# EAGLE design TouchSwitch-V2.0 (EAGLE 9.6.2)
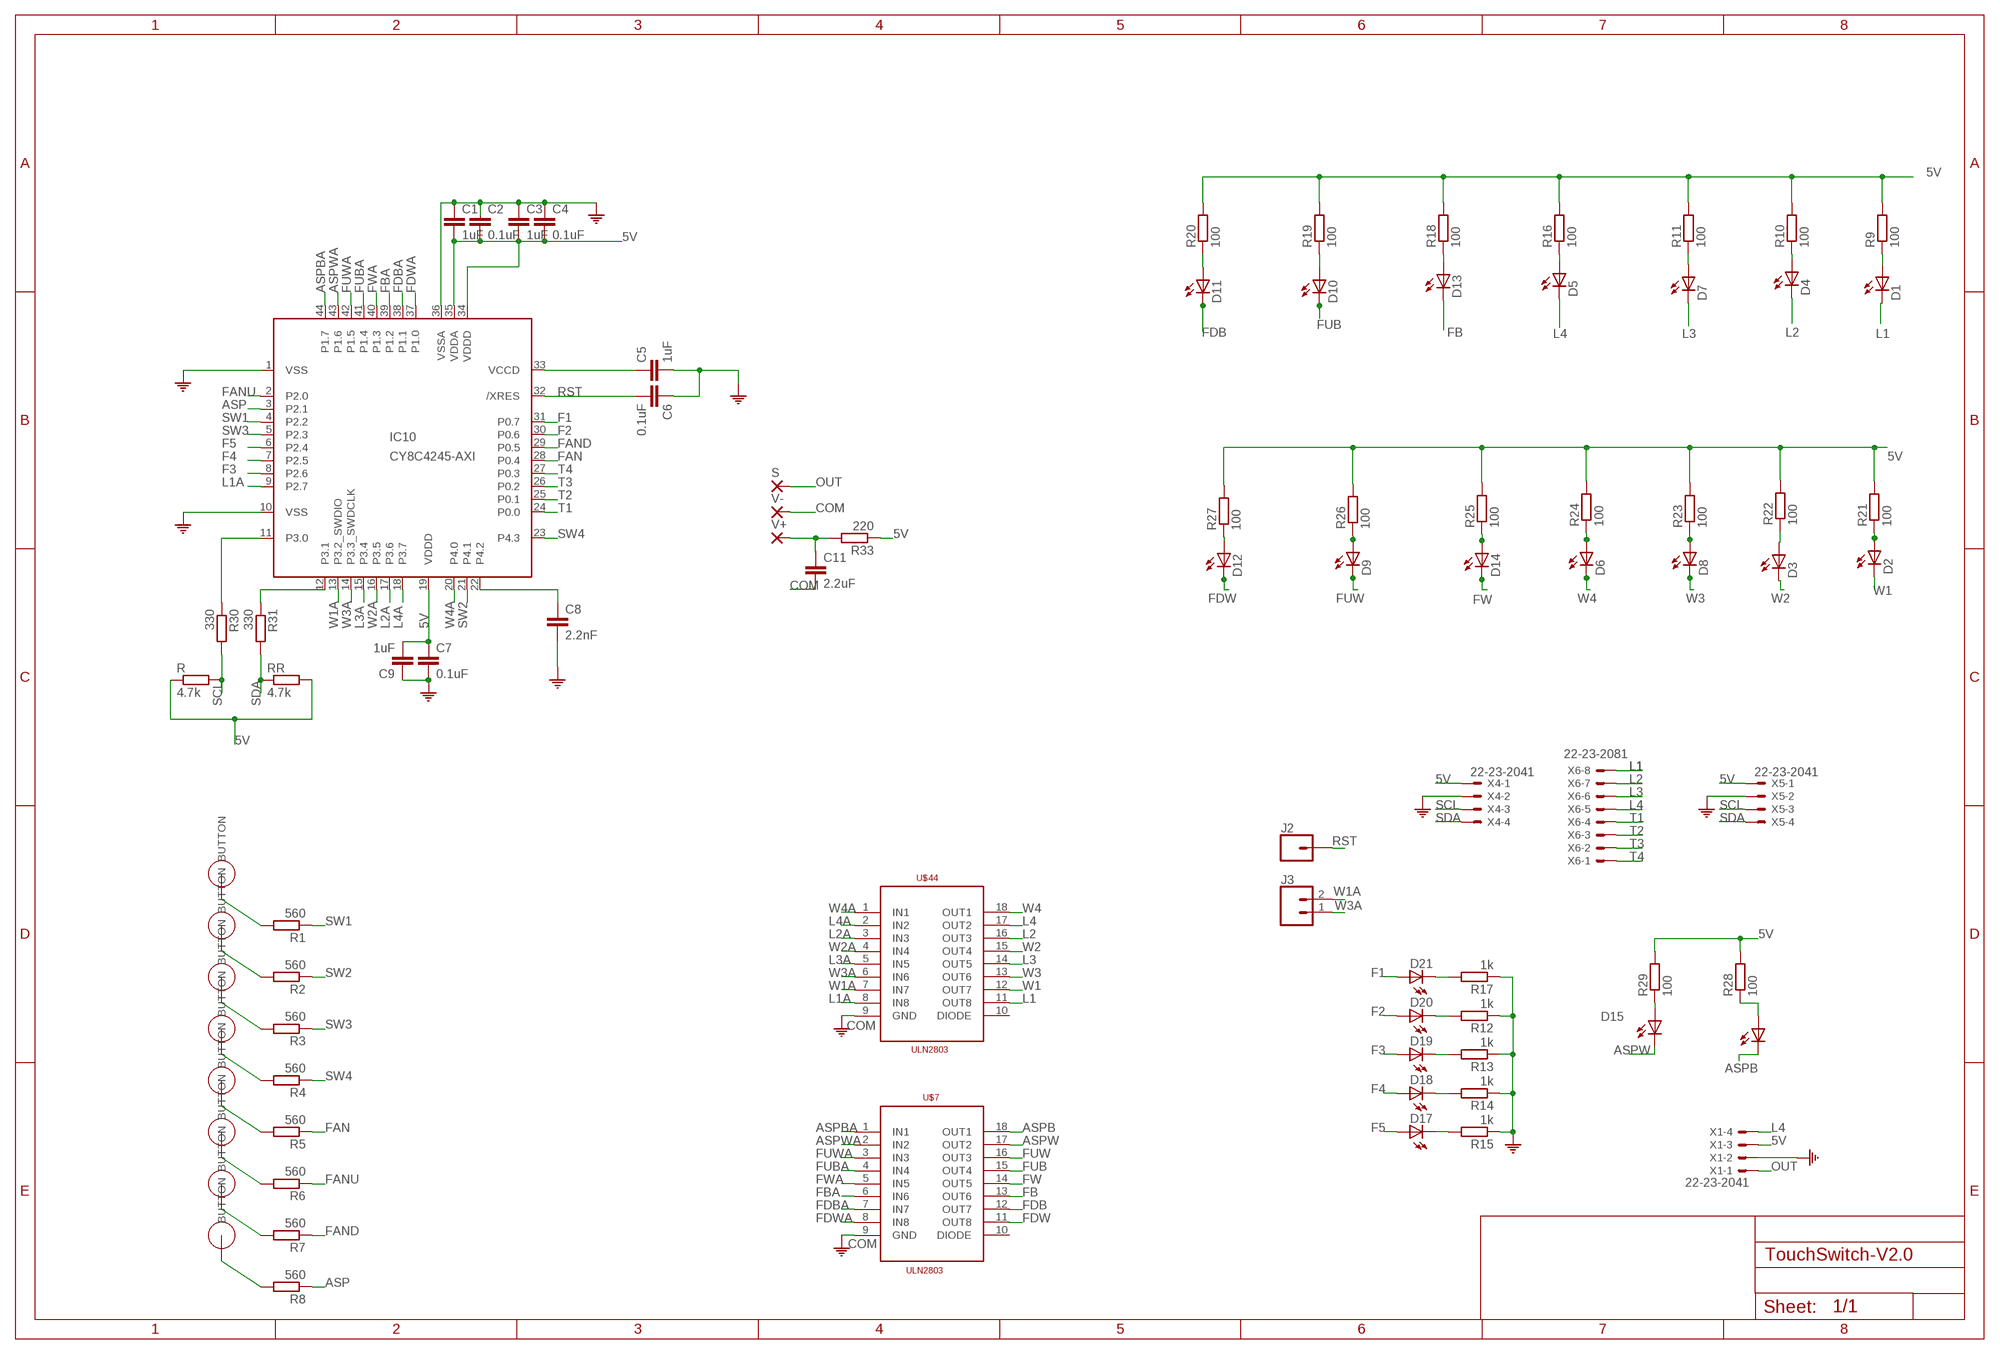
[diagram p0: schematic, sheet 1]

## Parts
B1  BUTTON_PASSIVE12MM  [BUTTON_PASSIVE_12MM]
B2  BUTTON_PASSIVE12MM  [BUTTON_PASSIVE_12MM]
B3  BUTTON_PASSIVE12MM  [BUTTON_PASSIVE_12MM]
B4  BUTTON_PASSIVE12MM  [BUTTON_PASSIVE_12MM]
B5  BUTTON_PASSIVE12MM  [BUTTON_PASSIVE_12MM]
B6  BUTTON_PASSIVE12MM  [BUTTON_PASSIVE_12MM]
B7  BUTTON_PASSIVE12MM  [BUTTON_PASSIVE_12MM]
B8  BUTTON_PASSIVE12MM  [BUTTON_PASSIVE_12MM]
C1  1uF  C-EUC1206  [C1206]
C2  0.1uF  C-EUC1206  [C1206]
C3  1uF  C-EUC1206  [C1206]
C4  0.1uF  C-EUC1206  [C1206]
C5  1uF  C-EUC1206  [C1206]
C6  0.1uF  C-EUC1206  [C1206]
C7  0.1uF  C-EUC1206  [C1206]
C8  2.2nF  C-EUC1206  [C1206]
C9  1uF  C-EUC1206  [C1206]
C11  2.2uF  C-EUC1206  [C1206]
D1  LEDCHIPLED_1206  [CHIPLED_1206]
D2  LEDCHIPLED_1206  [CHIPLED_1206]
D3  LEDCHIPLED_1206  [CHIPLED_1206]
D4  LEDCHIPLED_1206  [CHIPLED_1206]
D5  LEDCHIPLED_1206  [CHIPLED_1206]
D6  LEDCHIPLED_1206  [CHIPLED_1206]
D7  LEDCHIPLED_1206  [CHIPLED_1206]
D8  LEDCHIPLED_1206  [CHIPLED_1206]
D9  LEDCHIPLED_1206  [CHIPLED_1206]
D10  LEDCHIPLED_1206  [CHIPLED_1206]
D11  LEDCHIPLED_1206  [CHIPLED_1206]
D12  LEDCHIPLED_1206  [CHIPLED_1206]
D13  LEDCHIPLED_1206  [CHIPLED_1206]
D14  LEDCHIPLED_1206  [CHIPLED_1206]
D15  LEDCHIPLED_1206  [CHIPLED_1206]
D16  LEDCHIPLED_1206  [CHIPLED_1206]
D17  LEDCHIPLED_1206  [CHIPLED_1206]
D18  LEDCHIPLED_1206  [CHIPLED_1206]
D19  LEDCHIPLED_1206  [CHIPLED_1206]
D20  LEDCHIPLED_1206  [CHIPLED_1206]
D21  LEDCHIPLED_1206  [CHIPLED_1206]
IC10  CY8C4245-AXI  [44-TQFP-0.8]
J2  CONN_01  [1X01]
J3  CONN_02  [1X02]
R  4.7k  R-EU_R0805  [R0805]
R1  560  R-EU_R0805  [R0805]
R2  560  R-EU_R0805  [R0805]
R3  560  R-EU_R0805  [R0805]
R4  560  R-EU_R0805  [R0805]
R5  560  R-EU_R0805  [R0805]
R6  560  R-EU_R0805  [R0805]
R7  560  R-EU_R0805  [R0805]
R8  560  R-EU_R0805  [R0805]
R9  100  R-EU_R0805  [R0805]
R10  100  R-EU_R0805  [R0805]
R11  100  R-EU_R0805  [R0805]
R12  1k  R-EU_R0805  [R0805]
R13  1k  R-EU_R0805  [R0805]
R14  1k  R-EU_R0805  [R0805]
R15  1k  R-EU_R0805  [R0805]
R16  100  R-EU_R0805  [R0805]
R17  1k  R-EU_R0805  [R0805]
R18  100  R-EU_R0805  [R0805]
R19  100  R-EU_R0805  [R0805]
R20  100  R-EU_R0805  [R0805]
R21  100  R-EU_R0805  [R0805]
R22  100  R-EU_R0805  [R0805]
R23  100  R-EU_R0805  [R0805]
R24  100  R-EU_R0805  [R0805]
R25  100  R-EU_R0805  [R0805]
R26  100  R-EU_R0805  [R0805]
R27  100  R-EU_R0805  [R0805]
R28  100  R-EU_R0805  [R0805]
R29  100  R-EU_R0805  [R0805]
R30  330  R-EU_R0805  [R0805]
R31  330  R-EU_R0805  [R0805]
R33  220  R-EU_R0805  [R0805]
RR  4.7k  R-EU_R0805  [R0805]
S  SMD2  [SMD1,27-2,54]
U$7  ULN2803  [SO18L]
U$44  ULN2803  [SO18L]
V+  SMD2  [SMD1,27-2,54]
V-  SMD2  [SMD1,27-2,54]
X1  22-23-2041  [22-23-2041]
X4  22-23-2041  [22-23-2041]
X5  22-23-2041  [22-23-2041]
X6  22-23-2081  [22-23-2081]

## Nets
5V: C1.2 C2.2 C3.2 C4.2 C7.1 C9.2 IC10.19(VDDD) IC10.34(VDDD) IC10.35(VDDA) R9.2 R10.2 R11.2 R16.2 R18.2 R19.2 R20.2 R21.2 R22.2 R23.2 R24.2 R25.2 R26.2 R27.2 R28.2 R29.2 R33.1 R.1 RR.2 X1.3 X4.1 X5.1
ASP: IC10.3(P2.1) R8.1
ASPB: D16.C U$7.18(OUT1)
ASPBA: IC10.44(P1.7) U$7.1(IN1)
ASPW: D15.C U$7.17(OUT2)
ASPWA: IC10.43(P1.6) U$7.2(IN2)
COM: C1.1 C2.1 C3.1 C4.1 C5.2 C6.1 C7.2 C8.2 C9.1 C11.2 IC10.1(VSS) IC10.10(VSS) IC10.36(VSSA) R12.1 R13.1 R14.1 R15.1 R17.1 U$7.9(GND) U$44.9(GND) V-.1(P) X1.2 X4.2 X5.2
F1: D21.A IC10.31(P0.7)
F2: D20.A IC10.30(P0.6)
F3: D19.A IC10.8(P2.6)
F4: D18.A IC10.7(P2.5)
F5: D17.A IC10.6(P2.4)
FAN: IC10.28(P0.4) R5.1
FAND: IC10.29(P0.5) R7.1
FANU: IC10.2(P2.0) R6.1
FB: D13.C U$7.13(OUT6)
FBA: IC10.39(P1.2) U$7.6(IN6)
FDB: D11.C U$7.12(OUT7)
FDBA: IC10.38(P1.1) U$7.7(IN7)
FDW: D12.C U$7.11(OUT8)
FDWA: IC10.37(P1.0) U$7.8(IN8)
FUB: D10.C U$7.15(OUT4)
FUBA: IC10.41(P1.4) U$7.4(IN4)
FUW: D9.C U$7.16(OUT3)
FUWA: IC10.42(P1.5) U$7.3(IN3)
FW: D14.C U$7.14(OUT5)
FWA: IC10.40(P1.3) U$7.5(IN5)
L1: D1.C U$44.11(OUT8) X6.8
L1A: IC10.9(P2.7) U$44.8(IN8)
L2: D4.C U$44.16(OUT3) X6.7
L2A: IC10.17(P3.6) U$44.3(IN3)
L3: D7.C U$44.14(OUT5) X6.6
L3A: IC10.15(P3.4) U$44.5(IN5)
L4: D5.C U$44.17(OUT2) X1.4 X6.5
L4A: IC10.18(P3.7) U$44.2(IN2)
N$1: C8.1 IC10.22(P4.2)
N$2: B8.T.PAD(BUTTON) R1.2
N$3: IC10.11(P3.0) R30.1
N$4: B1.T.PAD(BUTTON) R2.2
N$5: IC10.12(P3.1) R31.1
N$6: D10.A R19.1
N$7: B2.T.PAD(BUTTON) R3.2
N$8: B3.T.PAD(BUTTON) R4.2
N$9: B4.T.PAD(BUTTON) R5.2
N$10: B5.T.PAD(BUTTON) R6.2
N$11: B6.T.PAD(BUTTON) R7.2
N$12: D13.A R18.1
N$13: C11.1 R33.2 V+.1(P)
N$14: D11.A R20.1
N$15: D5.A R16.1
N$16: B7.T.PAD(BUTTON) R8.2
N$17: D7.A R11.1
N$18: D20.C R12.2
N$19: D19.C R13.2
N$20: D18.C R14.2
N$21: D17.C R15.2
N$22: D21.C R17.2
N$23: D4.A R10.1
N$24: D1.A R9.1
N$25: D6.A R24.1
N$26: D12.A R27.1
N$27: D9.A R26.1
N$28: D14.A R25.1
N$29: D2.A R21.1
N$30: D3.A R22.1
N$31: D8.A R23.1
N$32: D16.A R28.1
N$34: D15.A R29.1
N$47: C5.1 IC10.33(VCCD)
OUT: S.1(P) X1.1
RST: C6.2 IC10.32(/XRES) J2.1
SCL: R30.2 R.2 X4.3 X5.3
SDA: R31.2 RR.1 X4.4 X5.4
SW1: IC10.4(P2.2) R1.1
SW2: IC10.21(P4.1) R2.1
SW3: IC10.5(P2.3) R3.1
SW4: IC10.23(P4.3) R4.1
T1: IC10.24(P0.0) X6.4
T2: IC10.25(P0.1) X6.3
T3: IC10.26(P0.2) X6.2
T4: IC10.27(P0.3) X6.1
W1: D2.C U$44.12(OUT7)
W1A: IC10.13(P3.2_SWDIO) J3.2 U$44.7(IN7)
W2: D3.C U$44.15(OUT4)
W2A: IC10.16(P3.5) U$44.4(IN4)
W3: D8.C U$44.13(OUT6)
W3A: IC10.14(P3.3_SWDCLK) J3.1 U$44.6(IN6)
W4: D6.C U$44.18(OUT1)
W4A: IC10.20(P4.0) U$44.1(IN1)
Unconnected: U$7.10(DIODE) U$44.10(DIODE)

## Library data of the parts
B1-B8 = touch_pad_:BUTTON_PASSIVE: Button, Passive Capacitive/Touch Sensing Type Source : http://www.PatternAgents.com Github : https://github.com/PatternAgents License : http://creativecommons.org/licenses/by-sa/3.1/ (Creative Commons 3.1) THIS SOFTWARE IS PROVIDED BY THE CONTRIBUTORS "AS IS" AND WITHOUT ANY EXPRESS OR IMPLIED WARRANTIES, INCLUDING, BUT NOT LIMITED TO, THE IMPLIED WARRANTIES OF MERCHANTABILITY AND FITNESS FOR A PARTICULAR PURPOSE ARE DISCLAIMED. IN NO EVENT SHALL THE COPYRIGHT OWNER OR CONTRIBUTORS BE LIABLE FOR ANY DIRECT, INDIRECT, INCIDENTAL, SPECIAL, EXEMPLARY, OR CONSEQUENTIAL DAMAGES (INCLUDING, BUT NOT LIMITED TO, PROCUREMENT OF SUBSTITUTE GOODS OR SERVICES; LOSS OF USE, DATA, OR PROFITS; OR BUSINESS INTERRUPTION) HOWEVER CAUSED AND ON ANY THEORY OF LIABILITY, WHETHER IN CONTRACT, STRICT LIABILITY, OR TORT (INCLUDING NEGLIGENCE OR OTHERWISE) ARISING IN ANY WAY OUT OF THE USE OF THIS SOFTWARE, EVEN IF ADVISED OF THE POSSIBILITY OF SUCH DAMAGE.
C1-C9 C11 = rcl:C-EU: CAPACITOR, European symbol; SPICEPREFIX: C
D1-D21 = led:LED: LED OSRAM: - CHIPLED LG R971, LG N971, LY N971, LG Q971, LY Q971, LO R971, LY R971 LH N974, LH R974 LS Q976, LO Q976, LY Q976 LO Q996 - Hyper CHIPLED LW Q18S LB Q993, LB Q99A, LB R99A - SideLED LS A670, LO A670, LY A670, LG A670, LP A670 LB A673, LV A673, LT A673, LW A673 LH A674 LY A675 LS A676, LA A676, LO A676, LY A676, LW A676 LS A679, LY A679, LG A679 - Hyper Micro SIDELED® LS Y876, LA Y876, LO Y876, LY Y876 LT Y87S - SmartLED LW L88C, LW L88S LB L89C, LB L89S, LG L890 LS L89K, LO L89K, LY L89K LS L896, LA L896, LO L896, LY L896 - TOPLED LS T670, LO T670, LY T670, LG T670, LP T670 LSG T670, LSP T670, LSY T670, LOP T670, LYG T670 LG T671, LOG T671, LSG T671 LB T673, LV T673, LT T673, LW T673 LH T674 LS T676, LA T676, LO T676, LY T676, LB T676, LH T676, LSB T676, LW T676 LB T67C, LV T67C, LT T67C, LS T67K, LO T67K, LY T67K, LW E67C LS E67B, LA E67B, LO E67B, LY E67B, LB E67C, LV E67C, LT E67C LW T67C LS T679, LY T679, LG T679 LS T770, LO T770, LY T770, LG T770, LP T770 LB T773, LV T773, LT T773, LW T773 LH T774 LS E675, LA E675, LY E675, LS T675 LS T776, LA T776, LO T776, LY T776, LB T776 LHGB T686 LT T68C, LB T68C - Hyper Mini TOPLED® LB M676 - Mini TOPLED Santana® LG M470 LS M47K, LO M47K, LY M47K Source: http://www.osram.convergy.de LUXEON: - LUMILED® LXK2-PW12-R00, LXK2-PW12-S00, LXK2-PW14-U00, LXK2-PW14-V00 LXK2-PM12-R00, LXK2-PM12-S00, LXK2-PM14-U00 LXK2-PE12-Q00, LXK2-PE12-R00, LXK2-PE12-S00, LXK2-PE14-T00, LXK2-PE14-U00 LXK2-PB12-K00, LXK2-PB12-L00, LXK2-PB12-M00, LXK2-PB14-N00, LXK2-PB14-P00, LXK2-PB14-Q00 LXK2-PR12-L00, LXK2-PR12-M00, LXK2-PR14-Q00, LXK2-PR14-R00 LXK2-PD12-Q00, LXK2-PD12-R00, LXK2-PD12-S00 LXK2-PH12-R00, LXK2-PH12-S00 LXK2-PL12-P00, LXK2-PL12-Q00, LXK2-PL12-R00 Source: www.luxeon.com KINGBRIGHT: KA-3528ASYC Source: www.kingbright.com
IC10 = CY8C4200:CY8C4245: PSOC4200 in TQFP-44 Source:
J2 = SparkFun-Connectors ASPIRE:CONN_01: Single connection point. Often used as Generic Header-pin footprint for 0.1 inch spaced/style header connections On any of the 0.1 inch spaced packages, you can populate with these: Break Away Headers - Straight <https://www.sparkfun.com/products/116> (PRT-00116) Break Away Male Headers - Right Angle <https://www.sparkfun.com/products/553> (PRT-00553) Female Headers <https://www.sparkfun.com/products/115> (PRT-00115) Break Away Headers - Machine Pin <https://www.sparkfun.com/products/117> (PRT-00117) Break Away Female Headers - Swiss Machine Pin <https://www.sparkfun.com/products/743> (PRT-00743) This device is also useful as a general connection point to wire up your design to another part of your project. Our various solder wires solder well into these plated through hole pads. Hook-Up Wire - Assortment (Stranded, 22 AWG) <https://www.sparkfun.com/products/11375> (PRT-11375) Hook-Up Wire - Assortment (Solid Core, 22 AWG) <https://www.sparkfun.com/products/11367> (PRT-11367) View the entire wire category on our website here <https://www.sparkfun.com/categories/141> Special notes: SMTSO-256-ET is a "flush mount" nut for a 4-40 screw. We mostly use this on specialty testbeds; it is a nice way to connect hardware to your PCB at an adjustable hieght. Also note, the SNAP packages are for using a snappable style connector. We sell a baggie of snaps and they are also used on two LilyPad designs: Snap Assortment - 30 pack (male and female) <https://www.sparkfun.com/products/11347> (DEV-11347) LilyPad Arduino SimpleSnap <https://www.sparkfun.com/products/10941> (DEV-10941) LilyPad SimpleSnap Protoboard <https://www.sparkfun.com/products/10940> (DEV-10940)
J3 = SparkFun-Connectors ASPIRE:CONN_02: Multi connection point. Often used as Generic Header-pin footprint for 0.1 inch spaced/style header connections On any of the 0.1 inch spaced packages, you can populate with these: Break Away Headers - Straight <https://www.sparkfun.com/products/116> (PRT-00116) Break Away Male Headers - Right Angle <https://www.sparkfun.com/products/553> (PRT-00553) Female Headers <https://www.sparkfun.com/products/115> (PRT-00115) Break Away Headers - Machine Pin <https://www.sparkfun.com/products/117> (PRT-00117) Break Away Female Headers - Swiss Machine Pin <https://www.sparkfun.com/products/743> (PRT-00743) For SCREWTERMINALS and SPRING TERMINALS visit here: Screw Terimnals on SparkFun.com <https://www.sparkfun.com/search/results?term=Screw+Terminals> (5mm/3.5mm/2.54mm spacing) This device is also useful as a general connection point to wire up your design to another part of your project. Our various solder wires solder well into these plated through hole pads. Hook-Up Wire - Assortment (Stranded, 22 AWG) <https://www.sparkfun.com/products/11375> (PRT-11375) Hook-Up Wire - Assortment (Solid Core, 22 AWG) <https://www.sparkfun.com/products/11367> (PRT-11367) View the entire wire category on our website here <https://www.sparkfun.com/categories/141> Special notes: Molex polarized connector foot print use with: PRT-08233 with associated crimp pins and housings. 2.54_SCREWTERM for use with PRT-10571. 3.5mm Screw Terminal footprints for PRT-08084 5mm Screw Terminal footprints for use with PRT-08432
R R1-R31 R33 RR = resistor:R-EU_: RESISTOR, European symbol
S V+ V- = wirepad:SMD2: SMD PAD
U$7 U$44 = uln2803:ULN2803
X1 X4 X5 = con-molex-new white color :22-23-2041: .100" (2.54mm) Center Header - 4 Pin
X6 = con-molex-new white color :22-23-2081: .100" (2.54mm) Center Header - 8 Pin

## Board
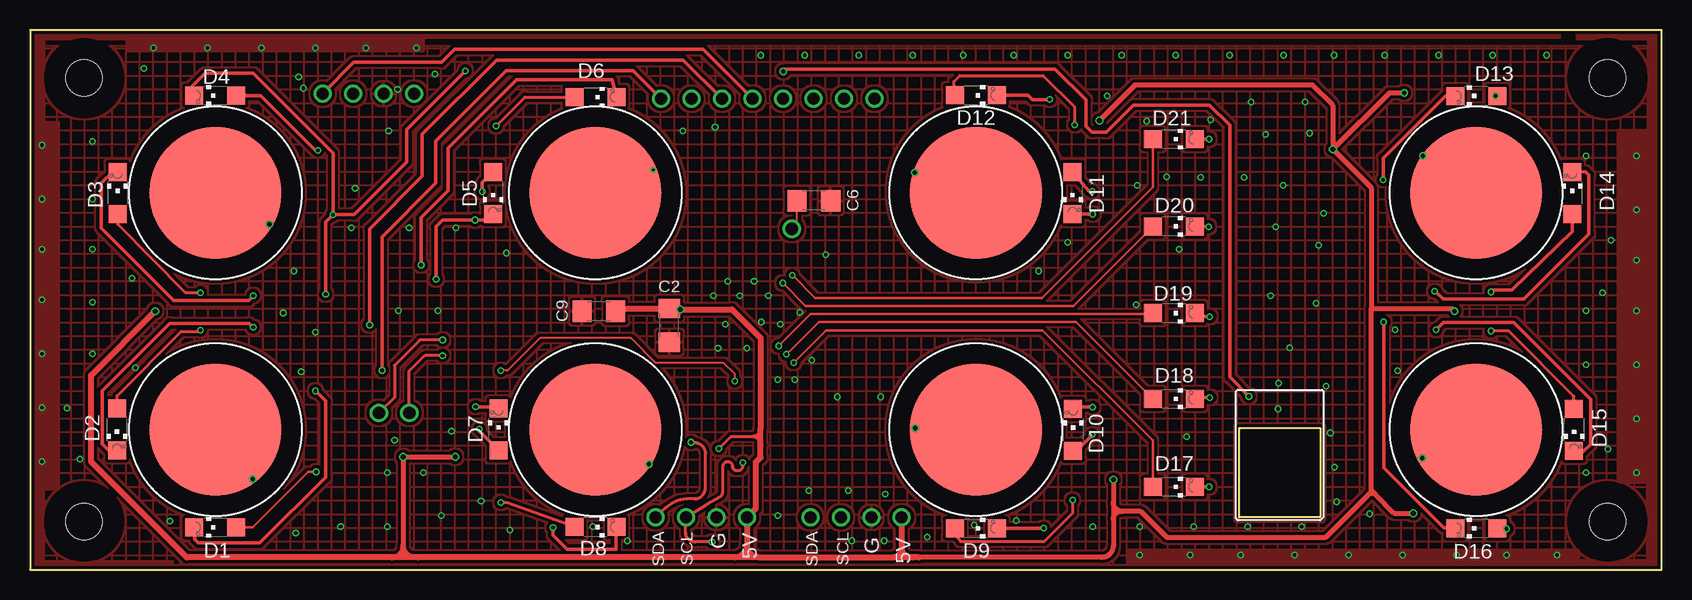
[diagram p1: board, top side]
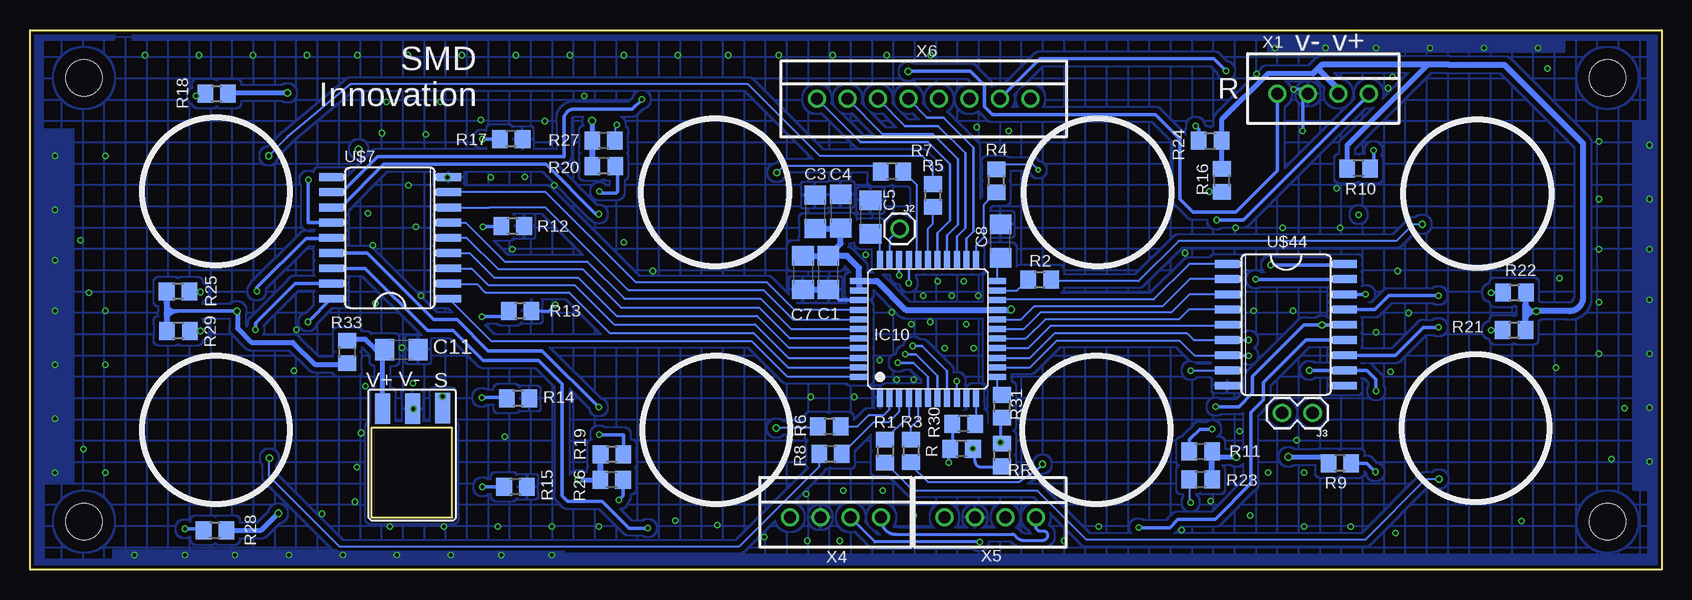
[diagram p2: board, bottom side, seen from below]

Size 136 x 45 mm. Coordinates in mm from the lower left corner, seen from the top.
Outline: 136,45 0,45 0,0 136,0 136,45
Outline: 107.55,4.35 100.8,4.35 100.8,11.8 107.55,11.8 107.55,4.35
Copper layers (1*16): Top 0.018mm / dielectric 1.55mm / Bottom 0.018mm
Design rules "eC_2Layer_PClass6_BaseCopperO18_eCDefault *": minimum track width 0.15mm, minimum drill 0.1mm, track to track 0.15mm, track to pad 0.15mm, pad to pad 0.15mm, via to via 0.15mm, smd to smd 0mil, copper to edge 0.25mm, drill to drill 0.35mm, minimum pad ring 0.175mm, minimum via ring 0.125mm, stop-mask expansion 0mil, vias tented up to drill 0.35mm, thermal gap 0.2mm
Holes 3 mm at 131.5,4 131.5,41 4.5,41 4.5,4
tRestrict: area 113.3,4.5 to 127.8,18.9; area 113.3,24.2 to 127.8,38.6; area 71.6,4.5 to 86,18.9; area 39.9,4.5 to 54.3,18.9; area 39.9,24.2 to 54.3,38.6; area 8.2,24.2 to 22.6,38.6; area 8.2,4.5 to 22.6,18.9; area 128.5,1 to 134.5,7; area 128.5,38 to 134.5,44; area 1.5,38 to 7.5,44; area 1.5,1 to 7.5,7; area 71.7,24.3 to 86.1,38.7
bRestrict: area 129.5,2 to 133.5,6; area 129.5,39 to 133.5,43; area 2.5,39 to 6.5,43; area 2.5,2 to 6.5,6

### Footprints (pad centres in the part's own frame; a part is rotated, then mirrored left to right if it is on the bottom)
BUTTON_PASSIVE_12MM = smd 11 x 11: T.PAD 0,0
C1206 = smd 1.6 x 1.8: 1 -1.4,0; 2 1.4,0
CHIPLED_1206 = smd 1.5 x 1.5: A 0,-1.75; C 0,1.75
44-TQFP-0.8 = smd 1.5 x 0.5: 1 -5.75,4; 2 -5.75,3.2; 3 -5.75,2.4; 4 -5.75,1.6; 5 -5.75,0.8; 6 -5.75,0; 7 -5.75,-0.8; 8 -5.75,-1.6; 9 -5.75,-2.4; 10 -5.75,-3.2; 11 -5.75,-4; 23 5.75,-4; 24 5.75,-3.2; 25 5.75,-2.4; 26 5.75,-1.6; 27 5.75,-0.8; 28 5.75,0; 29 5.75,0.8; 30 5.75,1.6; 31 5.75,2.4; 32 5.75,3.2; 33 5.75,4 | smd 0.5 x 1.5: 12 -4,-5.75; 13 -3.2,-5.75; 14 -2.4,-5.75; 15 -1.6,-5.75; 16 -0.8,-5.75; 17 0,-5.75; 18 0.8,-5.75; 19 1.6,-5.75; 20 2.4,-5.75; 21 3.2,-5.75; 22 4,-5.75; 34 4,5.75; 35 3.2,5.75; 36 2.4,5.75; 37 1.6,5.75; 38 0.8,5.75; 39 0,5.75; 40 -0.8,5.75; 41 -1.6,5.75; 42 -2.4,5.75; 43 -3.2,5.75; 44 -4,5.75
1X01 = drill 1.016 pad 1.5: 1 0,0
1X02 = drill 1.016 pad 1.5: 1 0,0; 2 2.54,0
R0805 = smd 1.3 x 1.5: 1 -0.95,0; 2 0.95,0
SMD1,27-2,54 = smd 1.27 x 2.54: 1 0,0
SO18L = smd 0.66 x 2.032: 1 -5.08,-4.902; 2 -3.81,-4.902; 3 -2.54,-4.902; 4 -1.27,-4.902; 5 0,-4.902; 6 1.27,-4.902; 7 2.54,-4.902; 8 3.81,-4.902; 9 5.08,-4.902; 10 5.08,4.902; 11 3.81,4.902; 12 2.54,4.902; 13 1.27,4.902; 14 0,4.902; 15 -1.27,4.902; 16 -2.54,4.902; 17 -3.81,4.902; 18 -5.08,4.902
22-23-2041 = drill 1: 1 -3.81,0; 2 -1.27,0; 3 1.27,0; 4 3.81,0
22-23-2081 = drill 1: 1 -8.89,0; 2 -6.35,0; 3 -3.81,0; 4 -1.27,0; 5 1.27,0; 6 3.81,0; 7 6.35,0; 8 8.89,0

### Placement (x,y rotation side)
B1  15.45,31.41 0 top
B2  47.14,11.67 0 top
B3  47.14,31.41 0 top
B4  120.55,31.41 0 top
B5  78.85,11.67 180 top
B6  78.85,31.41 180 top
B7  120.55,11.67 0 top
B8  15.45,11.67 0 top
C1  69.45,24.77 90 bottom
C2  53.3,20.37 90 top
C3  70.56,29.84 270 bottom
C4  68.42,29.89 270 bottom
C5  65.94,29.39 90 bottom
C6  65.34,30.77 180 top
C7  71.56,24.77 270 bottom
C8  55.1,27.39 90 bottom
C9  47.41,21.55 0 top
C11  105.05,18.35 0 bottom
D1  15.45,3.52 90 top
D2  7.25,11.67 180 top
D3  7.3,31.41 0 top
D4  15.45,39.53 90 top
D5  38.6,31.41 180 top
D6  47.14,39.4 270 top
D7  39.05,11.67 0 top
D8  47.14,3.55 270 top
D9  78.85,3.45 270 top
D10  86.95,11.67 0 top
D11  86.9,31.41 180 top
D12  78.85,39.54 270 top
D13  120.55,39.5 90 top
D14  128.55,31.41 0 top
D15  128.7,11.67 180 top
D16  120.55,3.45 90 top
D17  95.34,6.89 270 top
D18  95.34,14.24 270 top
D19  95.34,21.38 270 top
D20  95.34,28.62 270 top
D21  95.34,35.9 270 top
IC10  61.15,20.07 90 bottom
J2  63.49,28.41 180 bottom
J3  29.08,13.06 180 bottom
R  58.35,10.08 180 bottom
R1  64.71,9.87 270 bottom
R2  51.84,24.2 0 bottom
R3  62.55,9.9 270 bottom
R4  55.44,32.42 90 bottom
R5  60.73,31.2 90 bottom
R6  69.38,11.92 180 bottom
R7  64.15,33.2 180 bottom
R8  69.27,9.63 180 bottom
R9  26.81,8.88 180 bottom
R10  25.25,33.45 180 bottom
R11  38.41,9.85 0 bottom
R12  95.77,28.64 180 bottom
R13  95.14,21.57 180 bottom
R14  95.31,14.27 180 bottom
R15  95.53,6.91 180 bottom
R16  36.65,32.46 90 bottom
R17  95.89,35.91 180 bottom
R18  120.44,39.69 0 bottom
R19  87.49,9.61 180 bottom
R20  88.17,33.66 180 bottom
R21  12.29,19.99 0 bottom
R22  12.26,23.11 0 bottom
R23  38.41,7.52 0 bottom
R24  37.63,35.75 0 bottom
R25  123.66,23.19 180 bottom
R26  87.51,7.48 180 bottom
R27  88.19,35.78 180 bottom
R28  120.57,3.28 0 bottom
R29  123.63,19.91 180 bottom
R30  58.16,12.16 180 bottom
R31  54.99,13.62 270 bottom
R33  109.55,18.15 90 bottom
RR  55,9.56 270 bottom
S  101.6,13.45 180 bottom
U$7  106,27.66 90 bottom
U$44  31.3,20.41 270 bottom
V+  106.6,13.4 180 bottom
V-  104.1,13.4 180 bottom
X1  28.2,39.7 0 bottom
X4  68.86,4.37 0 bottom
X5  55.95,4.35 0 bottom
X6  61.5,39.25 0 bottom

### Tracks (layer width: path | path; a pad name or v marks a point on that pad's centre or on a via)
5V  (via drill 0.3, 0.35, 0.4)
  Top 0.152: 111.55,6.25 111.58,6.22 112.17,6.22
  Top 0.254: R.1 58.42,11.1 60.19,11.1 | 60.19,11.1 arc-90 60.9,10.39 | 60.19,11.1 60.23,11.1 arc90 60.9,11.77
  Top 0.406: v118.75,21.55 118.55,21.75 111.8,21.75 | v115.3,4.7 113.7,4.7 112.17,6.22 111.8,6.6 111.8,6.5 111.55,6.25 108,2.7 94.75,2.7 92.6,4.85 91.05,4.85 | 74.1,1.02 89.35,1.02 arc90 90.3,1.97 90.3,4.2 | 73.6,1.02 71.95,1.02 | v35.45,9.4 v31.1,9.4 31.1,2.05 | 31.1,2.05 31.1,1.95 arc-90 30.17,1.02 30.15,1.02 | 32.35,1.02 32.13,1.02 arc-90 31.1,2.05 | v90.3,7.5 90.3,5.6 | 90.3,5.6 90.3,4.2 | 90.3,4.2 arc-90 90.95,4.85 91.05,4.85 | 91.05,4.85 arc-90 90.3,5.6 | v89.15,37.45 92.1,40.4 106.91,40.4 108.6,38.71 v108.6,35.05 113.3,39.75 v114.55,39.75
  Top 0.407: v108.6,35.05 111.8,31.85 111.8,21.75
  Top 0.408: 111.8,6.6 111.8,21.75
  Top 0.5: 30.15,1.02 13.08,1.02 5.1,9 5.1,16.2 v10.45,21.55
  Top 0.508: X4.1 72.67,1.74 | 60.78,1.02 58.75,1.02 | 58.75,1.02 32.35,1.02 30.15,1.02 | 74.1,1.02 73.6,1.02 73.38,1.02 | 73.38,1.02 arc-90 72.67,1.74 | 72.67,1.74 arc-90 71.95,1.02 | 73.38,1.02 71.95,1.02 | 59.77,2.04 X5.1 60.52,5.1 60.52,8.96 60.9,9.35 60.9,10.39 60.9,11.77 60.9,19.3 58.5,21.7 v54.2,21.7 53.36,21.7 C2.2 49.02,21.77 C9.2 | 59.77,2.04 arc-90 58.75,1.02 | 60.78,1.02 arc-90 59.77,2.04 | 60.78,1.02 71.95,1.02
  Bottom 0.254: R.1 57.22,9.9 57.22,9.03 arc-90 56.74,8.55 55.05,8.55
  Bottom 0.305: 124.61,21.35 124.41,21.55 123.86,21.55 | 123.66,21.55 v118.75,21.55 | 123.66,21.55 arc-90 124.61,20.6 | 124.61,22.3 arc-90 123.86,21.55 | 123.86,21.55 123.66,21.55
  Bottom 0.406: R16.2 36.65,35.72 R24.2 36.68,37.52 32.83,41.37 29.05,41.37 | 55.05,8.55 arc-90 RR.2 | v115.3,4.7 116.72,3.28 R28.2 | v89.15,37.45 89.15,35.79 R27.2 | v90.3,7.5 88.48,7.5 R26.2 | v31.1,9.4 28.29,9.4 R9.2 | R11.2 37.02,9.4 v35.45,9.4 | 11.34,21.6 arc-90 11.29,21.55 10.9,21.55 | 10.9,21.55 10.6,21.55 | 10.6,21.55 10.49,21.55 | 11.34,22.1 11.34,21.99 arc-90 10.9,21.55 | v10.45,21.55 10.49,21.55 | 10.49,21.55 arc-90 11.34,20.7 | R22.2 11.3,22.25 arc-90 10.6,21.55 | R10.2 26.2,35.4 19.5,42.1 17.7,42.1 | v114.55,39.75 119.42,39.75 R18.2 | R33.1 109.64,17.11 112.25,17.11 114.1,18.96 117.55,18.96 118.7,20.11 118.7,21.5 v118.75,21.55
  Bottom 0.508: R25.2 124.61,22.3 124.61,21.35 124.61,20.6 124.61,19.94 R29.2 | R27.2 89.14,33.67 R20.2 | R26.2 88.44,7.5 R19.2 | IC10.34 IC10.35 | C7.1 C1.2 | C3.2 68.47,28.44 C4.2 68.42,27.19 C1.2 | R22.2 11.34,23.07 11.34,22.1 11.34,21.6 11.34,20.7 R21.2 | IC10.34 65.42,24.07 63.02,21.66 IC10.19 54.23,21.66 v54.2,21.7 | IC10.34 66.89,25.16 67.89,26.16 C1.2 | R23.2 R11.2 | v10.45,21.55 arc90 v10.45,21.55 7.67,21.55 arc-90 6.55,22.68 6.55,35.55 13.1,42.1 17.7,42.1 28.32,42.1 28.63,41.78 | 28.63,41.78 29.05,41.37 | X1.3 26.93,40.08 28.63,41.78
  other vias: 57.4,10.08
ASP
  Bottom 0.18: IC10.3 63.55,13.16 64.4,12.3 65.65,12.3 R8.1
ASPB  (via drill 0.3)
  Top 0.305: v112.85,20.65 112.85,8.46 117.86,3.5 118.75,3.5 D16.C
  Bottom 0.305: U$7.18 112.83,20.65 v112.85,20.65
ASPBA
  Bottom 0.18: IC10.44 72.86,16.07 75.85,19.05 97.56,19.05 U$7.1
ASPW  (via drill 0.3)
  Top 0.305: D15.C 129.45,9.8 130.1,10.45 130.1,14.2 123.7,20.6 117.8,20.6 v117.2,20
  Bottom 0.305: U$7.17 113.9,23.86 117.2,20.55 v117.2,20
ASPWA
  Bottom 0.18: U$7.2 101.04,23.8 98.74,23.8 98.04,23.11 91.04,23.11 87.69,19.75 75.7,19.75 72.81,16.87 IC10.43
COM  (via drill 0.3)
  Bottom 0.254: R13.1 92.73,21.57 v92.2,22.1
  Bottom 0.305: IC10.36 68.55,22.46 C1.1 | v30.65,40.05 29.82,40.05 X1.2 29.9,39.27 v29.9,36.6
  Bottom 0.508: C7.2 C1.1
  other vias: 133.9,8.1 129.7,8.1 133.9,12.6 133.9,17.1 133.9,21.6 133.9,25.8 133.9,30 133.9,34.5 129.7,34.5 131.1,23.1 131.8,27.45 129.7,21.6 129.7,17.1 131.55,10.05 93.1,37.4 98.4,37.5 101.8,39 106.3,39 106.65,36.4 103,36.3 104.45,32.05 101.2,32.7 97.6,32.7 89.8,39.5 92.3,32.05 107.4,27.05 107.85,29.7 107.2,22.2 103.4,22.85 103.85,28.6 105,18.5 104.1,15.55 104.05,13.4 96.4,11.1 108.05,15.3 108.39,11.4 86.5,27.3 84.1,24.9 94.75,32.75 95.8,26.7 126.4,42.9 100,42.9 104.5,42.9 108.7,42.9 112.9,42.9 117.4,42.9 121.9,42.9 95.5,42.9 69.1,42.9 73.6,42.9 77.8,42.9 82,42.9 86.5,42.9 91,42.9 106,3.6 101.5,3.6 97,3.6 92.5,3.6 111.65,4.65 108.75,8.55 108.9,5.65 88.6,3.6 82.2,4.1 78.7,3.7 74.8,2.7 71.2,2.4 68.5,2.4 71.3,6.3 68.2,6.6 64.9,6.6 70.9,14.4 67.3,14.4 14.8,43.5 10.3,43.5 23.8,19.8 21.1,21.4 22,24.9 27.1,31.8 57.1,36.9 54.4,36.6 33.75,41.35 64.6,42.9 60.9,42.9 22.6,16.5 34,21.6 30.7,21.6 39.7,26.4 35.5,28.5 31.6,28.5 26.8,28.5 29.8,3.6 25.9,3.6 29.8,8.1 32.8,8.1 34.3,4.5 40,3.3 11.65,4.05 22.15,3.05 30.4,10.8 46.9,3.6 49.8,2.4 19.3,43.5 23.8,43.5 28,43.5 32.2,43.5 9.5,41.8 4.15,9.2 1,9 3.1,13.45 5.2,18 5.2,22.3 5.2,26.7 5.2,30.9 5.2,35.7 1,35.4 1,30.9 1,26.7 1,22.5 1,18 1,13.5 8.5,24.3 8.8,16.85 114.4,1.2 92.5,1.2 96.7,1.2 100.9,1.2 105.4,1.2 109.9,1.2 118.9,1.2 123.1,1.2 127.3,1.2 61.55,22.85 59.15,22.85 56.95,22.85 60.35,24.05 58.15,24.05 64.15,21.45 62.55,20.45 60.95,20.65 59.75,18.45 57.35,18.45 57.95,20.45 62.35,15.85 63.75,15.85 65.15,17.45 66.35,26.25 113.8,20 114,16.6 35.15,11.55 37.6,5.7 22.8,40.15 22.4,41.1 62.35,4.5
  pour Bottom (isolate 0.381, hatched): 136,0 0,0 0,45 135.45,45.02 136,44.97
  pour Top (isolate 0.254, hatched): 136,0 0,0 0,43.7 136,43.7
  pour Top (isolate 0.23): 127.5,45 127.5,44.3 32.8,44.3 32.8,43.2 8.05,43.2 8.05,44.2 1.2,44.2 1.2,37.35 2.4,37.35 2.4,6.65 1.15,6.65 1.15,0.75 11.9,0.75 11.9,0.1 91.5,0.1 91.5,1.7 129.1,1.7 129.1,0.8 134.8,0.8 134.8,7.2 132.35,7.2 132.35,36.7 134.9,36.7 134.9,44.2 128.95,44.2 128.95,45 135.95,45 135.95,0 0.1,0 0.1,45
  pour Bottom (isolate 0.23): 127.5,44.95 127.5,44.2 32.8,44.2 32.8,43.2 8.05,43.2 8.05,44.2 1.2,44.2 1.2,37.35 2.4,37.35 2.4,6.65 1.15,6.65 1.15,1.25 91.5,1.25 91.5,1.6 129.1,1.6 129.1,0.8 134.8,0.8 134.8,7.2 132.35,7.2 132.35,36.7 134.9,36.7 134.9,44.2 128.95,44.2 128.95,45 135.95,45 135.95,0.05 0.05,0.05 0.05,44.95
F1  (via drill 0.3)
  Top 0.203: v63.55,24.55 65.45,22.65 84.35,22.65 93.59,31.89 D21.A
  Bottom 0.18: v63.55,24.55
  Bottom 0.203: IC10.31 v63.55,24.55
F2  (via drill 0.3)
  Top 0.203: v62.75,23.9 64.65,22 86.97,22 D20.A
  Bottom 0.18: v62.74,23.91 v62.75,23.9
  Bottom 0.203: IC10.30 v62.74,23.91
F3  (via drill 0.3)
  Top 0.18: D19.A 93.55,21.33
  Top 0.203: 93.55,21.33 65.08,21.33 v62.4,18.65
  Bottom 0.203: v62.4,18.65 61.65,18.65 59.55,16.55 IC10.8
F4  (via drill 0.3)
  Top 0.203: D18.A 87.18,20.65 65.75,20.65 v63.05,17.95
  Bottom 0.203: IC10.7 60.34,16.15 62.15,17.95 v63.05,17.95
F5  (via drill 0.3)
  Top 0.203: D17.A 93.59,10.76 84.4,19.95 66.35,19.95 v63.65,17.25
  Bottom 0.203: IC10.6 61.15,16.05 62.34,17.25 v63.65,17.25
FAN
  Bottom 0.18: IC10.28 61.15,28.46 60.73,28.87 R5.1
FAND
  Bottom 0.18: IC10.29 62.05,25.91 62.05,32.05 R7.1
FANU
  Bottom 0.18: IC10.2 64.34,13.36 64.8,12.9 66.05,12.9 67.03,11.92 R6.1
FB  (via drill 0.3)
  Top 0.305: v112.8,32.5 v112.79,32.51 112.79,34.31 117.98,39.5 D13.C
  Bottom 0.305: U$7.13 112.8,28.94 v112.8,32.5
FBA
  Bottom 0.18: IC10.39 72.56,20.07 75.1,22.6 86.45,22.6 89.55,25.7 96.46,25.7 99.69,28.94 U$7.6
FDB  (via drill 0.3)
  Top 0.305: v88.6,29.65 87.14,29.65 D11.C
  Bottom 0.305: v88.6,29.65 88.85,29.65 93,33.8 106.5,33.8 110.1,30.21 U$7.12
FDBA
  Bottom 0.18: U$7.7 97.7,30.21 93.05,30.21 86.14,23.3 74.85,23.3 72.42,20.87 IC10.38
FDW  (via drill 0.3)
  Top 0.305: D12.C 83.2,39.54 83.55,39.2 v85,39.2
  Bottom 0.305: v85,39.2 85.8,38.4 90.65,38.4 arc-90 91.5,37.55 91.5,34.45 107.02,34.45 110,31.48 U$7.11
FDWA
  Bottom 0.18: IC10.37 72.27,21.66 74.55,23.95 85.5,23.95 93.03,31.48 U$7.8
FUB  (via drill 0.3)
  Top 0.254: 87.08,13.55 D10.C
  Top 0.305: v88.6,13.55 87.08,13.55
  Bottom 0.305: U$7.15 107.9,26.39 102.35,20.85 100.39,20.85 97.8,18.25 93.3,18.25 v88.6,13.55
FUBA
  Bottom 0.18: IC10.41 72.72,18.46 75.4,21.15 87.1,21.15 90.29,24.35 97.29,24.35 99.34,26.39 U$7.4
FUW  (via drill 0.3)
  Top 0.305: v84.5,3.45 D9.C
  Bottom 0.305: U$7.16 108.05,25.12 102.85,19.93 100.72,19.93 98.25,17.45 93.6,17.45 91.65,15.5 91.65,6.15 91.2,5.7 88.3,5.7 86.05,3.45 v84.5,3.45
FUWA
  Bottom 0.18: U$7.3 99.19,25.12 97.79,23.73 90.59,23.73 87.32,20.45 75.55,20.45 72.77,17.66 IC10.42
FW  (via drill 0.3)
  Top 0.305: v117.1,23.2 117.15,23.2 117.8,22.55 124.5,22.55 129.95,28 129.95,32.9 129.65,33.2 D14.C
  Bottom 0.305: v117.1,23.2 117.1,23.51 113,27.62 110.95,27.62 U$7.14
FWA
  Bottom 0.18: IC10.40 72.67,19.27 75.25,21.85 86.75,21.85 89.95,25.05 96.98,25.05 99.59,27.66 U$7.5
L1  (via drill 0.3, 0.35)
  Top 0.305: v29.35,16.6 29.35,27.75 33.83,32.22 33.83,35.72 39.7,41.6 50.27,41.6 X6.8 | D1.C 13.73,2.52 14.04,2.22 19.16,2.22 24.65,7.68 24.65,14.05 v23.8,14.9
  Bottom 0.305: v23.8,14.9 23.8,15.85 24.55,16.61 U$44.11 v29.34,16.61 v29.35,16.6
L1A  (via drill 0.3)
  Top 0.18: v39.25,16.6 39.8,16.6 42.5,19.3 50.1,19.3 52.15,17.25 57.8,17.25 58.75,16.3 v58.75,15.7
  Bottom 0.18: v39.25,16.6 U$44.8 | v58.75,15.7 v58.74,15.7 IC10.9
L2  (via drill 0.3)
  Top 0.305: v25.25,29.6 27,29.6 31.4,34 31.4,36.7 v36.3,41.6 | D4.C 13.37,40.13 14.62,41.38 18.62,41.38 25.25,34.75 v25.25,29.6 | v24.65,22.95 24.65,29 v25.25,29.6
  Bottom 0.305: U$44.16 v24.66,22.96 v24.65,22.95 | X6.7 51.8,42.6 37.3,42.6 v36.3,41.6
L2A
  Bottom 0.18: IC10.17 53.13,20.07 51.77,21.43 40.88,21.43 39.34,22.96 U$44.3
L3  (via drill 0.3, 0.35)
  Top 0.254: 38.94,13.58 D7.C
  Top 0.305: v28.3,20.4 28.3,28.4 32.7,32.8 32.7,36.3 38.9,42.5 54.45,42.5 X6.6 | v37.15,13.58 38.94,13.58
  Bottom 0.305: v37.15,13.58 35.25,13.58 34.09,14.74 34.09,16.11 29.8,20.4 v28.3,20.4 26.41,20.4 U$44.14
L3A
  Bottom 0.18: IC10.15 52.78,18.46 50.95,20.3 36.31,20.3 U$44.5
L4  (via drill 0.3)
  Top 0.305: D5.C 38.1,29.16 37.12,29.16 v37.1,29.15 34.4,29.15 33.85,28.6 v33.85,24.2 | X6.5 56.09,43.4 35.4,43.4 34.3,42.3 26.99,42.3 X1.4
  Bottom 0.305: v33.85,24.2 26.42,24.2 U$44.17 | v37.1,29.15 34.85,29.15 24.39,39.61 X1.4
L4A
  Bottom 0.18: U$44.2 39.33,24.23 41.6,21.95 52.3,21.95 53.38,20.87 IC10.18
N$1
  Bottom 0.18: C8.1 55.4,25.7 IC10.22
N$2  (via drill 0.35)
  Top 0.18: B8.T.PAD 18.55,8.57 v18.55,7.55
  Bottom 0.18: R1.2 62.39,6.6 52.05,6.6 47.95,2.5 24.7,2.5 19.65,7.55 v18.55,7.55
N$3
  Bottom 0.18: IC10.11 57.15,12.23 R30.1
N$4  (via drill 0.35)
  Top 0.18: B1.T.PAD 18.07,28.8 v19.95,28.8
  Bottom 0.18: R2.2 50.74,24.05 43.6,24.05 40.25,27.4 22.1,27.4 20.7,28.8 v19.95,28.8
N$5
  Bottom 0.18: IC10.12 55.4,14.96 R31.1
N$6  (via drill 0.3)
  Top 0.254: 87.22,9.92 D10.A
  Top 0.305: v88.55,11.25 87.22,9.92
  Bottom 0.305: R19.1 86.54,11.25 v88.55,11.25
N$7  (via drill 0.35)
  Top 0.18: B2.T.PAD 50.01,8.8 v51.6,8.8
  Bottom 0.18: R3.2 62.55,8.7 61.16,7.3 53.56,7.3 51.6,8.71 v51.6,8.8
N$8  (via drill 0.2)
  Top 0.18: B3.T.PAD 49.08,33.35 v51.95,33.35
  Bottom 0.18: R4.2 54.99,33.82 52.42,33.82 v51.95,33.35
N$9  (via drill 0.35)
  Top 0.18: B4.T.PAD 117.47,34.5 v116.1,34.5
  Bottom 0.18: R5.2 60.73,33.63 61.6,34.5 70.15,34.5 76.15,40.5 109.26,40.5 114.55,36.05 v116.1,34.5
N$10  (via drill 0.35)
  Top 0.18: B5.T.PAD 73.93,11.67 v73.8,11.8
  Bottom 0.18: R6.2 70.43,11.82 73.78,11.82 v73.8,11.8
N$11  (via drill 0.35)
  Top 0.18: B6.T.PAD 75.44,31.41 v73.75,33.1
  Bottom 0.18: R7.2 65.6,33.7 73.14,33.7 v73.75,33.1
N$12  (via drill 0.3)
  Top 0.305: v122.15,39.5 122.22,39.57 D13.A
  Bottom 0.305: v122.15,39.5 121.96,39.69 R18.1
N$13
  Bottom 0.4: C11.1 106.74,18.06 106.65,18.05 106.65,13.45 V+.1
  Bottom 0.407: C11.1 107.2,18.35 108.05,19.2 109.45,19.2 R33.2
N$14  (via drill 0.3)
  Top 0.305: D11.A 88.27,31.55 v88.55,31.55
  Bottom 0.305: v88.55,31.55 88.4,31.4 87.14,31.4 87.03,31.51 87.03,33.46 R20.1
N$15  (via drill 0.3)
  Top 0.305: D5.A 37.7,32.27 v37.7,31.52
  Bottom 0.254: R16.1
  Bottom 0.305: v37.7,31.52 R16.1
N$16  (via drill 0.35)
  Top 0.18: B7.T.PAD 118.42,11.67 v116.05,9.3
  Bottom 0.18: R8.2 70.22,8.58 76.9,1.9 110.18,1.9 116.05,7.77 v116.05,9.3
N$17  (via drill 0.3)
  Top 0.305: v37.45,11.7 37.45,11.57 D7.A
  Bottom 0.305: R11.1 39.37,10.84 38.5,11.7 v37.45,11.7
N$18  (via drill 0.3)
  Top 0.305: v98.25,28.6 97.12,28.6 D20.C
  Bottom 0.305: v98.25,28.6 96.75,28.6 R12.2
N$19  (via drill 0.3)
  Top 0.254: 97.38,21.1 D19.C
  Top 0.305: v98.35,21.1 97.38,21.1
  Bottom 0.254: R13.2 96.56,21.1
  Bottom 0.305: 96.56,21.1 v98.35,21.1
N$20  (via drill 0.3)
  Top 0.305: D18.C 97.21,14.35 v98.35,14.35
  Bottom 0.305: R14.2 96.34,14.35 v98.35,14.35
N$21  (via drill 0.3)
  Top 0.305: v98.3,6.9 97.1,6.9 D17.C
  Bottom 0.305: R15.2 v98.3,6.91 v98.3,6.9
N$22  (via drill 0.3)
  Top 0.305: v98.3,35.9 D21.C
  Bottom 0.305: v98.3,35.9 R17.2
N$23  (via drill 0.3)
  Top 0.305: v24,34.95 23.8,34.95 19.21,39.53 D4.A
  Bottom 0.305: R10.1 24,33.75 v24,34.95
N$24  (via drill 0.3)
  Top 0.202: D1.A 18.57,3.52 23.2,8.15 v23.85,8.15
  Bottom 0.305: R9.1 24.57,8.88 v23.85,8.15
N$25  (via drill 0.3)
  Top 0.254: v38.85,37 41.25,39.4 D6.A
  Bottom 0.305: R24.1 38.58,36.73 v38.85,37
N$26  (via drill 0.3)
  Top 0.254: D12.A 77,40.7 77.5,41.2 84.45,41.2 87.1,38.55 v87.1,37.1
  Bottom 0.152: v87.1,37.1 87.23,36.96 R27.1
N$27  (via drill 0.3)
  Top 0.254: D9.A 77.3,2.67 77.56,2.35 84.55,2.35 86.9,4.7 v86.9,5.8
  Bottom 0.305: R26.1 86.56,6.14 v86.9,5.8
N$28  (via drill 0.3)
  Top 0.305: v121.8,23.15 121.95,23.3 123.51,23.3 128.55,28.19 D14.A
  Bottom 0.305: R25.1 122.67,23.15 v121.8,23.15
N$29  (via drill 0.3)
  Top 0.254: v14.2,19.96 14.1,19.86 12.61,19.86 7.25,14.5 D2.A
  Bottom 0.254: v14.2,19.96 13.27,19.96 R21.1
N$30  (via drill 0.3)
  Top 0.254: D3.A 7.3,28.79 12.95,23.1 v14.2,23.1
  Bottom 0.305: R22.1 v14.19,23.11 v14.2,23.1
N$31  (via drill 0.3)
  Top 0.254: v39.25,5.6 39.77,5.6 45.03,3.71 D8.A
  Bottom 0.152: R23.1 39.37,5.71 v39.25,5.6
N$32  (via drill 0.3)
  Top 0.305: v123.1,3.4 123.1,3.25 122.9,3.45 D16.A
  Bottom 0.305: v123.1,3.4 121.64,3.4 R28.1
N$34  (via drill 0.3)
  Top 0.254: D15.A 128.7,14.45 123.25,19.9 v121.8,19.9
  Bottom 0.305: R29.1 122.67,19.9 v121.8,19.9
N$47
  Bottom 0.18: IC10.33 65.14,27.21 C5.1
OUT  (via drill 0.35)
  Top 0.305: v101.6,14.45 100,16.05 100,37.05 98.32,38.73 91.97,38.73 89.71,36.47 88.54,36.47 88.02,36.99 88.02,39.18 85.45,41.75 63,41.75 v62.8,41.55
  Bottom 0.254: S.1 v101.6,14.45
  Bottom 0.305: v62.8,41.55 57.6,41.55 56.45,40.4 56.45,38.62 55.78,37.95 42.2,37.95 40.15,35.9 40.15,30.9 39.05,29.8 35.5,29.8 32.01,33.29 X1.1
RST
  Top 0.18: J2.1 63.95,28.87 C6.2
  Bottom 0.18: IC10.32 64.34,27.57 J2.1
SCL  (via drill 0.3)
  Top 0.254: v59.41,8.93 59.41,8.63 arc-90 59.02,8.24 58.93,8.24 arc-90 58.57,8.6 arc90 58.19,8.99 58.15,8.99 arc90 57.73,8.57 57.73,6.51 arc-45 57.55,6.08 56.45,5.45 X5.3 arc90 54.65,4.31 54.65,3.1 arc90 55.45,2.3 v56.85,2.3
  Bottom 0.254: v59.41,8.93 59.41,9.96 R.2 59.12,10.27 R30.2 | X4.3 65.57,2.3 v56.85,2.3
SDA  (via drill 0.35)
  Top 0.254: X5.4 52.77,4.97 arc-45 55.01,5.9 55.4,5.9 arc90 56.3,6.8 56.3,9.65 arc90 55.34,10.61 v55.1,10.61
  Bottom 0.254: R31.2 55.1,12.56 v55.1,10.61 RR.1 | X4.4 65.05,4.14 arc-90 63.85,2.95 54.13,2.95 arc45 53.91,2.86 53.67,2.62 arc-45 53.26,2.45 51.55,2.45 arc-90 51.15,2.85 arc-90 51.5,3.2 51.8,3.2 arc90 52.15,3.55 X5.4 arc90 X5.4
SW1
  Bottom 0.18: IC10.4 62.74,12.81 64.71,10.84 R1.1
SW2
  Bottom 0.18: IC10.21 53.72,23.27 R2.1
SW3
  Bottom 0.18: IC10.5 61.95,12.5 62.55,11.89 R3.1
SW4
  Bottom 0.18: R4.1 56.52,30.39 56.52,27.68 57.15,27.05 IC10.23
T1
  Bottom 0.203: IC10.24 57.95,27.61 57.35,28.2 57.35,35.2 59.85,37.7 61.22,37.7 X6.4
T2
  Bottom 0.203: IC10.25 58.74,27.75 58.02,28.48 58.02,34.71 60.3,36.99 63.05,36.99 X6.3
T3
  Bottom 0.203: IC10.26 59.55,27.88 58.63,28.79 58.63,34.23 60.73,36.32 64.92,36.32 X6.2
T4
  Bottom 0.203: IC10.27 60.34,28.05 59.3,29.1 59.3,33.8 61.15,35.64 66.78,35.64 X6.1
W1  (via drill 0.3)
  Top 0.305: D2.C 6.85,9.65 6,10.5 6,14.9 11.64,20.54 18.26,20.54 v18.6,20.2
  Bottom 0.305: U$44.12 22.18,17.88 19.85,20.2 v18.6,20.2
W1A  (via drill 0.3)
  Top 0.254: v34.4,17.85 32.9,17.85 31.62,16.57 J3.2
  Bottom 0.18: U$44.7 38.95,17.88 40.17,19.1 50.4,19.1 52.63,16.87 IC10.13
  Bottom 0.254: U$44.7 34.42,17.88 v34.4,17.85
W2  (via drill 0.3)
  Top 0.305: D3.C 6.97,33.25 5.95,32.22 5.95,28.49 11.97,22.42 18.23,22.42 18.6,22.79 v18.6,22.85
  Bottom 0.305: U$44.15 23.91,21.69 22.75,22.85 v18.6,22.85
W2A
  Bottom 0.18: IC10.16 52.98,19.27 51.38,20.88 40.23,20.88 39.41,21.69 U$44.4
W3  (via drill 0.3)
  Top 0.305: v43.6,3.5 43.6,2.87 44.77,1.7 48.85,1.7 48.85,3.4 D8.C
  Bottom 0.305: U$44.13 29.66,19.14 33.2,15.6 33.2,14.15 34.23,13.12 34.23,7.17 37.2,4.2 40.3,4.2 41,3.5 v43.6,3.5
W3A  (via drill 0.3)
  Top 0.254: v34.4,19.15 32.5,19.15 30.38,17.03 30.38,14.36 J3.1
  Bottom 0.18: IC10.14 52.63,17.66 50.58,19.73 39.58,19.73 39,19.14 U$44.6
  Bottom 0.254: U$44.6 v34.41,19.14 v34.4,19.15
W4  (via drill 0.3)
  Top 0.305: v32.6,25.4 32.6,29.35 34.85,31.6 34.85,35.15 40.58,40.88 48.52,40.88 D6.C
  Bottom 0.305: U$44.18 26.49,25.4 v32.6,25.4
W4A
  Bottom 0.18: U$44.1 39.37,25.5 42.35,22.52 55.34,22.52 IC10.20

### Text on the board
tPlace: SDA | SCL | G | 5V | SDA | SCL | G | 5V
tNames: D15
bNames: SMD / Innovation | v+ | v- | R